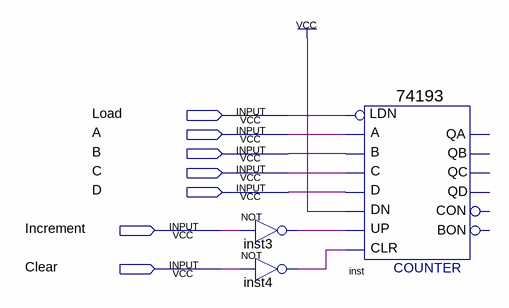
[diagram p0: schematic sheet]
// Quartus schematic Block2.bdf as structural Verilog: 3 symbols, 7 pins
module Block2 (
  input  Load,
  input  A,
  input  B,
  input  C,
  input  D,
  input  Increment,
  input  Clear
);

  wire inst3_out, inst4_out;

  not inst3 (inst3_out, Increment);
  not inst4 (inst4_out, Clear);
  \74193  inst (
    .D(D), .C(C), .B(B), .A(A), .CLR(inst4_out), .UP(inst3_out), .DN(1'b1), .LDN(Load));  // open: QB, QA, CON, QD, QC, BON
endmodule
